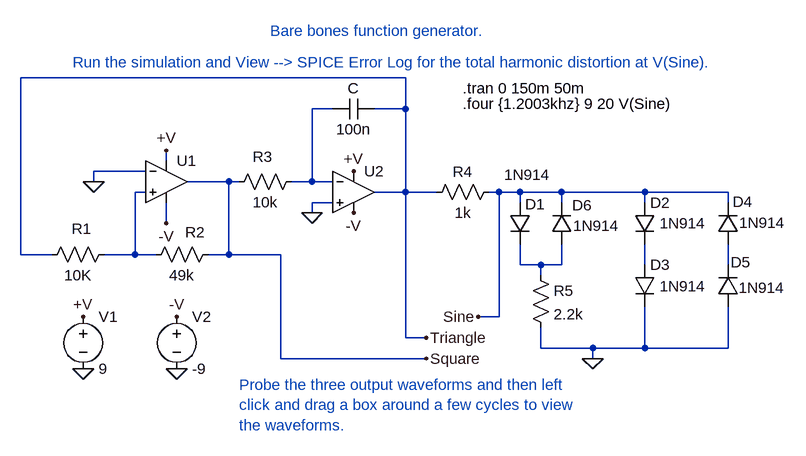
[diagram p0: schematic FuncGen.asc]
FuncGen.asc, the LTspice schematic file:
Version 4
SHEET 1 880 680
WIRE -320 -368 -912 -368
WIRE -432 -320 -464 -320
WIRE -320 -320 -320 -368
WIRE -320 -320 -368 -320
WIRE -688 -240 -688 -256
WIRE -720 -224 -800 -224
WIRE -800 -208 -800 -224
WIRE -592 -208 -656 -208
WIRE -576 -208 -592 -208
WIRE -464 -208 -464 -320
WIRE -464 -208 -496 -208
WIRE -432 -208 -464 -208
WIRE -720 -192 -736 -192
WIRE -320 -192 -320 -320
WIRE -320 -192 -368 -192
WIRE -272 -192 -320 -192
WIRE -176 -192 -192 -192
WIRE -144 -192 -176 -192
WIRE -80 -192 -144 -192
WIRE 48 -192 -80 -192
WIRE 176 -192 48 -192
WIRE -432 -176 -464 -176
WIRE -144 -176 -144 -192
WIRE -80 -176 -80 -192
WIRE 48 -176 48 -192
WIRE 176 -176 176 -192
WIRE -464 -160 -464 -176
WIRE -688 -144 -688 -176
WIRE -912 -96 -912 -368
WIRE -864 -96 -912 -96
WIRE -736 -96 -736 -192
WIRE -736 -96 -784 -96
WIRE -704 -96 -736 -96
WIRE -592 -96 -592 -208
WIRE -592 -96 -624 -96
WIRE -512 -96 -592 -96
WIRE -144 -80 -144 -112
WIRE -112 -80 -144 -80
WIRE -80 -80 -80 -112
WIRE -80 -80 -112 -80
WIRE 48 -80 48 -112
WIRE 176 -80 176 -112
WIRE -112 -64 -112 -80
WIRE -176 0 -176 -192
WIRE -176 0 -208 0
WIRE -320 32 -320 -192
WIRE -288 32 -320 32
WIRE -112 48 -112 16
WIRE -32 48 -112 48
WIRE 48 48 48 -16
WIRE 48 48 -32 48
WIRE 176 48 176 -16
WIRE 176 48 48 48
WIRE -512 64 -512 -96
WIRE -288 64 -512 64
WIRE -32 64 -32 48
FLAG -672 0 -V
FLAG -816 80 0
FLAG -672 80 0
FLAG -688 -144 -V
FLAG -400 -160 -V
FLAG -464 -160 0
FLAG -800 -208 0
FLAG -688 -256 +V
FLAG -816 0 +V
FLAG -400 -224 +V
FLAG -32 64 0
FLAG -288 32 Triangle
FLAG -208 0 Sine
FLAG -288 64 Square
SYMBOL res -768 -112 R90
WINDOW 0 -8 50 VBottom 0
WINDOW 3 32 56 VTop 0
SYMATTR InstName R1
SYMATTR Value 10K
SYMBOL res -608 -112 R90
WINDOW 0 -3 36 VBottom 0
WINDOW 3 32 56 VTop 0
SYMATTR InstName R2
SYMATTR Value 49k
SYMBOL res -480 -224 R90
WINDOW 0 -7 60 VBottom 0
WINDOW 3 32 56 VTop 0
SYMATTR InstName R3
SYMATTR Value 10k
SYMATTR SpiceLine tol=1 pwr=0.1
SYMBOL cap -368 -336 R90
WINDOW 0 0 32 VBottom 0
WINDOW 3 32 32 VTop 0
SYMATTR InstName C
SYMATTR Value 100n
SYMBOL voltage -816 -16 R0
WINDOW 123 0 0 Left 0
SYMATTR InstName V1
SYMATTR Value 9
SYMATTR SpiceLine Rser=0
SYMBOL voltage -672 -16 R0
WINDOW 123 0 0 Left 0
SYMATTR InstName V2
SYMATTR Value -9
SYMATTR SpiceLine Rser=0
SYMBOL Opamps\\UniversalOpamp -688 -208 R0
SYMATTR InstName U1
SYMBOL Opamps\\UniversalOpamp -400 -192 R0
SYMATTR InstName U2
SYMBOL res -176 -208 R90
WINDOW 0 0 56 VBottom 0
WINDOW 3 32 56 VTop 0
SYMATTR InstName R4
SYMATTR Value 1k
SYMBOL diode -160 -176 R0
WINDOW 0 24 3 Left 0
WINDOW 3 -8 -43 Left 0
SYMATTR InstName D1
SYMATTR Value 1N914
SYMBOL diode 32 -176 R0
WINDOW 3 161 31 Left 0
SYMATTR Value 1N914
SYMATTR InstName D2
SYMBOL diode 32 -80 R0
WINDOW 3 39 33 Left 0
SYMATTR Value 1N914
SYMATTR InstName D3
SYMBOL diode 192 -112 R180
WINDOW 0 -22 65 Left 0
WINDOW 3 50 32 Left 0
SYMATTR InstName D4
SYMATTR Value 1N914
SYMBOL diode 192 -16 R180
WINDOW 0 -19 68 Left 0
WINDOW 3 -72 29 Left 0
SYMATTR InstName D5
SYMATTR Value 1N914
SYMBOL diode -64 -112 R180
WINDOW 0 -31 60 Left 0
WINDOW 3 -73 28 Left 0
SYMATTR InstName D6
SYMATTR Value 1N914
SYMBOL res -128 -80 R0
SYMATTR InstName R5
SYMATTR Value 2.2k
TEXT -232 -352 Left 0 !.tran 0 150m 50m
TEXT -528 -440 Left 0 ;Bare bones function generator.
TEXT -232 -328 Left 0 !.four {1.2003khz} 9 20 V(Sine)
TEXT -832 -392 Left 0 ;Run the simulation and View --> SPICE Error Log for the total harmonic distortion at V(Sine).
TEXT -576 104 Left 0 ;Probe the three output waveforms and then left\nclick and drag a box around a few cycles to view\nthe waveforms.

The netlist it stands for:
* FuncGen.asc
R1 N002 Triangle 10K
R2 Square N002 49k
R3 N001 Square 10k tol=1 pwr=0.1
C Triangle N001 100n
V1 +V 0 9 Rser=0
V2 -V 0 -9 Rser=0
XU1 N002 0 +V -V Square level1 Avol=1Meg GBW=10Meg Vos=0 En=0 Enk=0 In=0 Ink=0 Rin=500Meg  ; pins In+ In- V+ V- OUT
XU2 0 N001 +V -V Triangle level1 Avol=1Meg GBW=10Meg Vos=0 En=0 Enk=0 In=0 Ink=0 Rin=500Meg  ; pins In+ In- V+ V- OUT
R4 Sine Triangle 1k
D1 Sine N003 1N914
D2 Sine N004 1N914
D3 N004 0 1N914
D4 N005 Sine 1N914
D5 0 N005 1N914
D6 N003 Sine 1N914
R5 N003 0 2.2k
.model D D
.lib standard.dio
.tran 0 150m 50m
* Bare bones function generator.
.four {1.2003khz} 9 20 V(Sine)
* Run the simulation and View --> SPICE Error Log for the total harmonic distortion at V(Sine).
* Probe the three output waveforms and then left
* click and drag a box around a few cycles to view
* the waveforms.
.lib UniversalOpAmp1.lib
.backanno
.end